# EAGLE design Hauptstation (EAGLE 7.3.0)
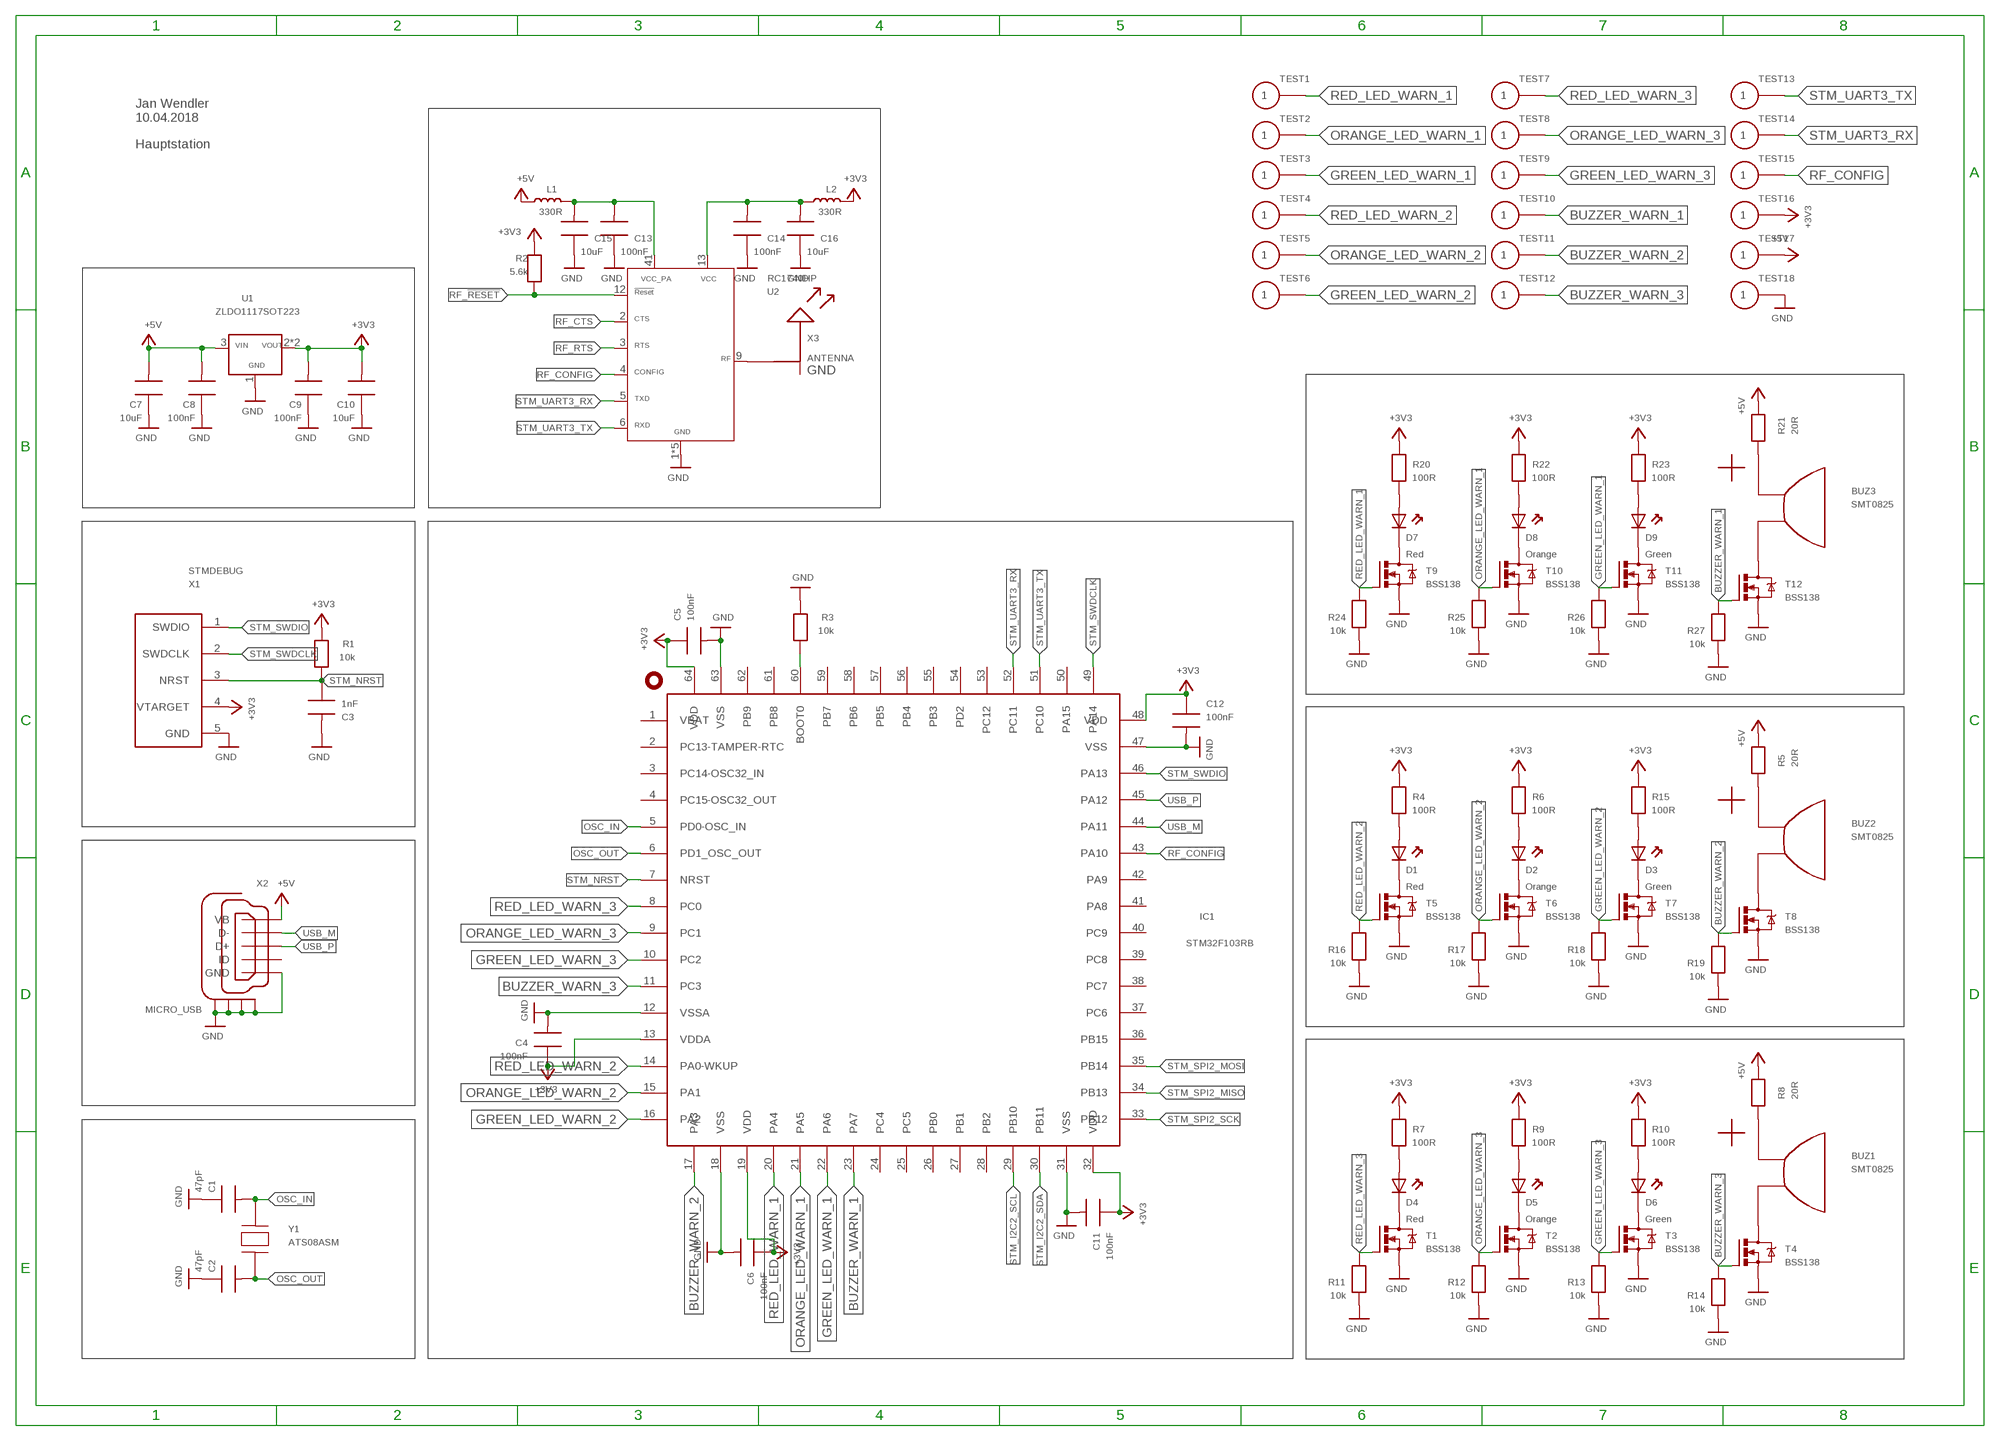
[diagram p0: schematic, sheet 1]

## Parts
BUZ1  SMT0825  [SMT0825]
BUZ2  SMT0825  [SMT0825]
BUZ3  SMT0825  [SMT0825]
C1  47pF  C0603  [0603]
C2  47pF  C0603  [0603]
C3  1nF  C0603  [0603]
C4  100nF  C0603  [0603]
C5  100nF  C0603  [0603]
C6  100nF  C0603  [0603]
C7  10uF  C0603  [0603]
C8  100nF  C0603  [0603]
C9  100nF  C0603  [0603]
C10  10uF  C0603  [0603]
C11  100nF  C0603  [0603]
C12  100nF  C0603  [0603]
C13  100nF  C0603  [0603]
C14  100nF  C0603  [0603]
C15  10uF  C0603  [0603]
C16  10uF  C0603  [0603]
D1  Red  D0603  [0603]
D2  Orange  D0603  [0603]
D3  Green  D0603  [0603]
D4  Red  D0603  [0603]
D5  Orange  D0603  [0603]
D6  Green  D0603  [0603]
D7  Red  D0603  [0603]
D8  Orange  D0603  [0603]
D9  Green  D0603  [0603]
IC1  STM32F103RB  [LQFP64]
L1  330R  L0603  [0603]
L2  330R  L0603  [0603]
R1  10k  R0603  [0603]
R2  5.6k  R0603  [0603]
R3  10k  R0603  [0603]
R4  100R  R0603  [0603]
R5  20R  R0603  [0603]
R6  100R  R0603  [0603]
R7  100R  R0603  [0603]
R8  20R  R0603  [0603]
R9  100R  R0603  [0603]
R10  100R  R0603  [0603]
R11  10k  R0603  [0603]
R12  10k  R0603  [0603]
R13  10k  R0603  [0603]
R14  10k  R0603  [0603]
R15  100R  R0603  [0603]
R16  10k  R0603  [0603]
R17  10k  R0603  [0603]
R18  10k  R0603  [0603]
R19  10k  R0603  [0603]
R20  100R  R0603  [0603]
R21  20R  R0603  [0603]
R22  100R  R0603  [0603]
R23  100R  R0603  [0603]
R24  10k  R0603  [0603]
R25  10k  R0603  [0603]
R26  10k  R0603  [0603]
R27  10k  R0603  [0603]
T1  BSS138  [SOT23]
T2  BSS138  [SOT23]
T3  BSS138  [SOT23]
T4  BSS138  [SOT23]
T5  BSS138  [SOT23]
T6  BSS138  [SOT23]
T7  BSS138  [SOT23]
T8  BSS138  [SOT23]
T9  BSS138  [SOT23]
T10  BSS138  [SOT23]
T11  BSS138  [SOT23]
T12  BSS138  [SOT23]
TEST1  TESTPIN  [TESTPIN]
TEST2  TESTPIN  [TESTPIN]
TEST3  TESTPIN  [TESTPIN]
TEST4  TESTPIN  [TESTPIN]
TEST5  TESTPIN  [TESTPIN]
TEST6  TESTPIN  [TESTPIN]
TEST7  TESTPIN  [TESTPIN]
TEST8  TESTPIN  [TESTPIN]
TEST9  TESTPIN  [TESTPIN]
TEST10  TESTPIN  [TESTPIN]
TEST11  TESTPIN  [TESTPIN]
TEST12  TESTPIN  [TESTPIN]
TEST13  TESTPIN  [TESTPIN]
TEST14  TESTPIN  [TESTPIN]
TEST15  TESTPIN  [TESTPIN]
TEST16  TESTPIN  [TESTPIN]
TEST17  TESTPIN  [TESTPIN]
TEST18  TESTPIN  [TESTPIN]
U1  ZLDO1117SOT223  [SOT223]
U2  RC1740HP  [RADIOCRAFTS_MODULE]
X1  STMDEBUG  [STIFTLEISTE1X5]
X2  MICRO_USB  [MICRO-USB]
X3  ANTENNA  [ANTENNE_CON]
Y1  ATS08ASM  [HC49/US]

## Nets
+3V3 [Power]: C4.2 C5.2 C6.2 C9.1 C10.1 C11.2 C12.2 IC1.13(VDDA) IC1.19(VDD) IC1.32(VDD) IC1.48(VDD) IC1.64(VDD) L2.1 R1.2 R2.2 R4.2 R6.2 R7.2 R9.2 R10.2 R15.2 R20.2 R22.2 R23.2 TEST16.1 U1.2(VOUT) U1.PAD(VOUT) X1.4(VTARGET)
+5V [Power]: C7.1 C8.1 L1.2 R5.2 R8.2 R21.2 TEST17.1 U1.3(VIN) X2.1(VB)
BUZZER_WARN_1: IC1.23(PA7) R27.2 T12.1(G) TEST10.1
BUZZER_WARN_2: IC1.17(PA3) R19.2 T8.1(G) TEST11.1
BUZZER_WARN_3: IC1.11(PC3) R14.2 T4.1(G) TEST12.1
GND [Power]: C1.2 C2.2 C3.1 C4.1 C5.1 C6.1 C7.2 C8.2 C9.2 C10.2 C11.1 C12.1 C13.2 C14.2 C15.2 C16.2 IC1.12(VSSA) IC1.18(VSS) IC1.31(VSS) IC1.47(VSS) IC1.63(VSS) R3.2 R11.1 R12.1 R13.1 R14.1 R16.1 R17.1 R18.1 R19.1 R24.1 R25.1 R26.1 R27.1 T1.2(S) T2.2(S) T3.2(S) T4.2(S) T5.2(S) T6.2(S) T7.2(S) T8.2(S) T9.2(S) T10.2(S) T11.2(S) T12.2(S) TEST18.1 U1.1(GND) U2.1(GND) U2.7(GND) U2.8(GND) U2.10(GND) U2.14(GND) X1.5(GND) X2.5(GND) X2.GND1(S1) X2.GND2(S2) X2.GND3(S3) X2.GND4(S4)
GREEN_LED_WARN_1: IC1.22(PA6) R26.2 T11.1(G) TEST3.1
GREEN_LED_WARN_2: IC1.16(PA2) R18.2 T7.1(G) TEST6.1
GREEN_LED_WARN_3: IC1.10(PC2) R13.2 T3.1(G) TEST9.1
N$1 [Data]: U2.9(RF) X3.P$1
N$2 [Data]: C13.1 C15.1 L1.1 U2.41(VCC_PA)
N$3 [Data]: C14.1 C16.1 L2.2 U2.13(VCC)
N$4: D4.1(ANODE) R7.1
N$5: D5.1(ANODE) R9.1
N$6: IC1.60(BOOT0) R3.1
N$7: D6.1(ANODE) R10.1
N$8: D4.2(KATHODE) T1.3(D)
N$9: D5.2(KATHODE) T2.3(D)
N$10: D6.2(KATHODE) T3.3(D)
N$11: BUZ1.+ R8.1
N$12: BUZ1.- T4.3(D)
N$13: D1.1(ANODE) R4.1
N$14: D2.1(ANODE) R6.1
N$15: D3.1(ANODE) R15.1
N$16: D1.2(KATHODE) T5.3(D)
N$17: D2.2(KATHODE) T6.3(D)
N$18: D3.2(KATHODE) T7.3(D)
N$19: BUZ2.+ R5.1
N$20: BUZ2.- T8.3(D)
N$21: D7.1(ANODE) R20.1
N$22: D8.1(ANODE) R22.1
N$23: D9.1(ANODE) R23.1
N$24: D7.2(KATHODE) T9.3(D)
N$25: D8.2(KATHODE) T10.3(D)
N$26: D9.2(KATHODE) T11.3(D)
N$27: BUZ3.+ R21.1
N$28: BUZ3.- T12.3(D)
ORANGE_LED_WARN_1: IC1.21(PA5) R25.2 T10.1(G) TEST2.1
ORANGE_LED_WARN_2: IC1.15(PA1) R17.2 T6.1(G) TEST5.1
ORANGE_LED_WARN_3: IC1.9(PC1) R12.2 T2.1(G) TEST8.1
OSC_IN [Data]: C1.1 IC1.5(PD0-OSC_IN) Y1.1
OSC_OUT [Data]: C2.1 IC1.6(PD1_OSC_OUT) Y1.2
RED_LED_WARN_1: IC1.20(PA4) R24.2 T9.1(G) TEST1.1
RED_LED_WARN_2: IC1.14(PA0-WKUP) R16.2 T5.1(G) TEST4.1
RED_LED_WARN_3: IC1.8(PC0) R11.2 T1.1(G) TEST7.1
RF_!RESET! [Data]: R2.1 U2.12(!RESET!)
RF_CONFIG [Data]: IC1.43(PA10) TEST15.1 U2.4(CONFIG)
RF_CTS [Data]: U2.2(CTS)
RF_RTS [Data]: U2.3(RTS)
STM_I2C2_SCL [Data]: IC1.29(PB10)
STM_I2C2_SDA [Data]: IC1.30(PB11)
STM_NRST [Data]: C3.2 IC1.7(NRST) R1.1 X1.3(NRST)
STM_SPI2_MISO [Data]: IC1.34(PB13)
STM_SPI2_MOSI [Data]: IC1.35(PB14)
STM_SPI2_SCK [Data]: IC1.33(PB12)
STM_SWDCLK [Data]: IC1.49(PA14) X1.2(SWDCLK)
STM_SWDIO [Data]: IC1.46(PA13) X1.1(SWDIO)
STM_UART3_RX [Data]: IC1.52(PC11) TEST14.1 U2.5(TXD)
STM_UART3_TX [Data]: IC1.51(PC10) TEST13.1 U2.6(RXD)
USB_M [Data]: IC1.44(PA11) X2.2(D-)
USB_P [Data]: IC1.45(PA12) X2.3(D+)
Unconnected: IC1.1(VBAT) IC1.2(PC13-TAMPER-RTC) IC1.3(PC14-OSC32_IN) IC1.4(PC15-OSC32_OUT) IC1.24(PC4) IC1.25(PC5) IC1.26(PB0) IC1.27(PB1) IC1.28(PB2) IC1.36(PB15) IC1.37(PC6) IC1.38(PC7) IC1.39(PC8) IC1.40(PC9) IC1.41(PA8) IC1.42(PA9) IC1.50(PA15) IC1.53(PC12) IC1.54(PD2) IC1.55(PB3) IC1.56(PB4) IC1.57(PB5) IC1.58(PB6) IC1.59(PB7) IC1.61(PB8) IC1.62(PB9) X2.4(ID) X3.P$2(GND)

## Notes on the sheet
- Jan Wendler
  10.04.2018
- Hauptstation

## Library data of the parts
BUZ1-BUZ3 = Warnsystem:SMT0825
C1-C16 = Hauptstation:C0603: Capacitor 0603
D1-D9 = Hauptstation:D0603: SMD LED 0603
IC1 = Hauptstation:STM32F103RB: STM32F103RB Digikey: 497-6066-ND
L1 L2 = Hauptstation:L0603: 0603 Spule
R1-R27 = Hauptstation:R0603: Resistor 0603
T1-T12 = Warnsystem:BSS138: N-Channel MOS FET BSS138 Ideal für LED ansteuerung
TEST1-TEST18 = Hauptstation:TESTPIN
U1 = Hauptstation:ZLDO1117: Voltage Regulator 3V3 / 1A / 1.3V DropOut Digikey: ZLDO1117G33DICT-ND
U2 = Hauptstation:RC1740HP: RC1740HC Digikey: 1783-1050-1-ND
X1 = Hauptstation:STMDEBUG: Debug Connector for STLinkV2 1x5 Stiftleiste
X2 = Hauptstation:MICRO_USB: Micro USB plug Digikey 609-4613-1-ND
X3 = Hauptstation:ANTENNA: RF Antenna 433Mhz
Y1 = Hauptstation:ATS08ASM: Crystal 8Mhz 20pF Digikey: CTX1055CT-ND

## Net classes
1 Power: width 0.254 mm, drill 0.5 mm, clearance 0.2 mm
2 Data: width 0.254 mm, drill 0.35 mm, clearance 0.2 mm

## Board
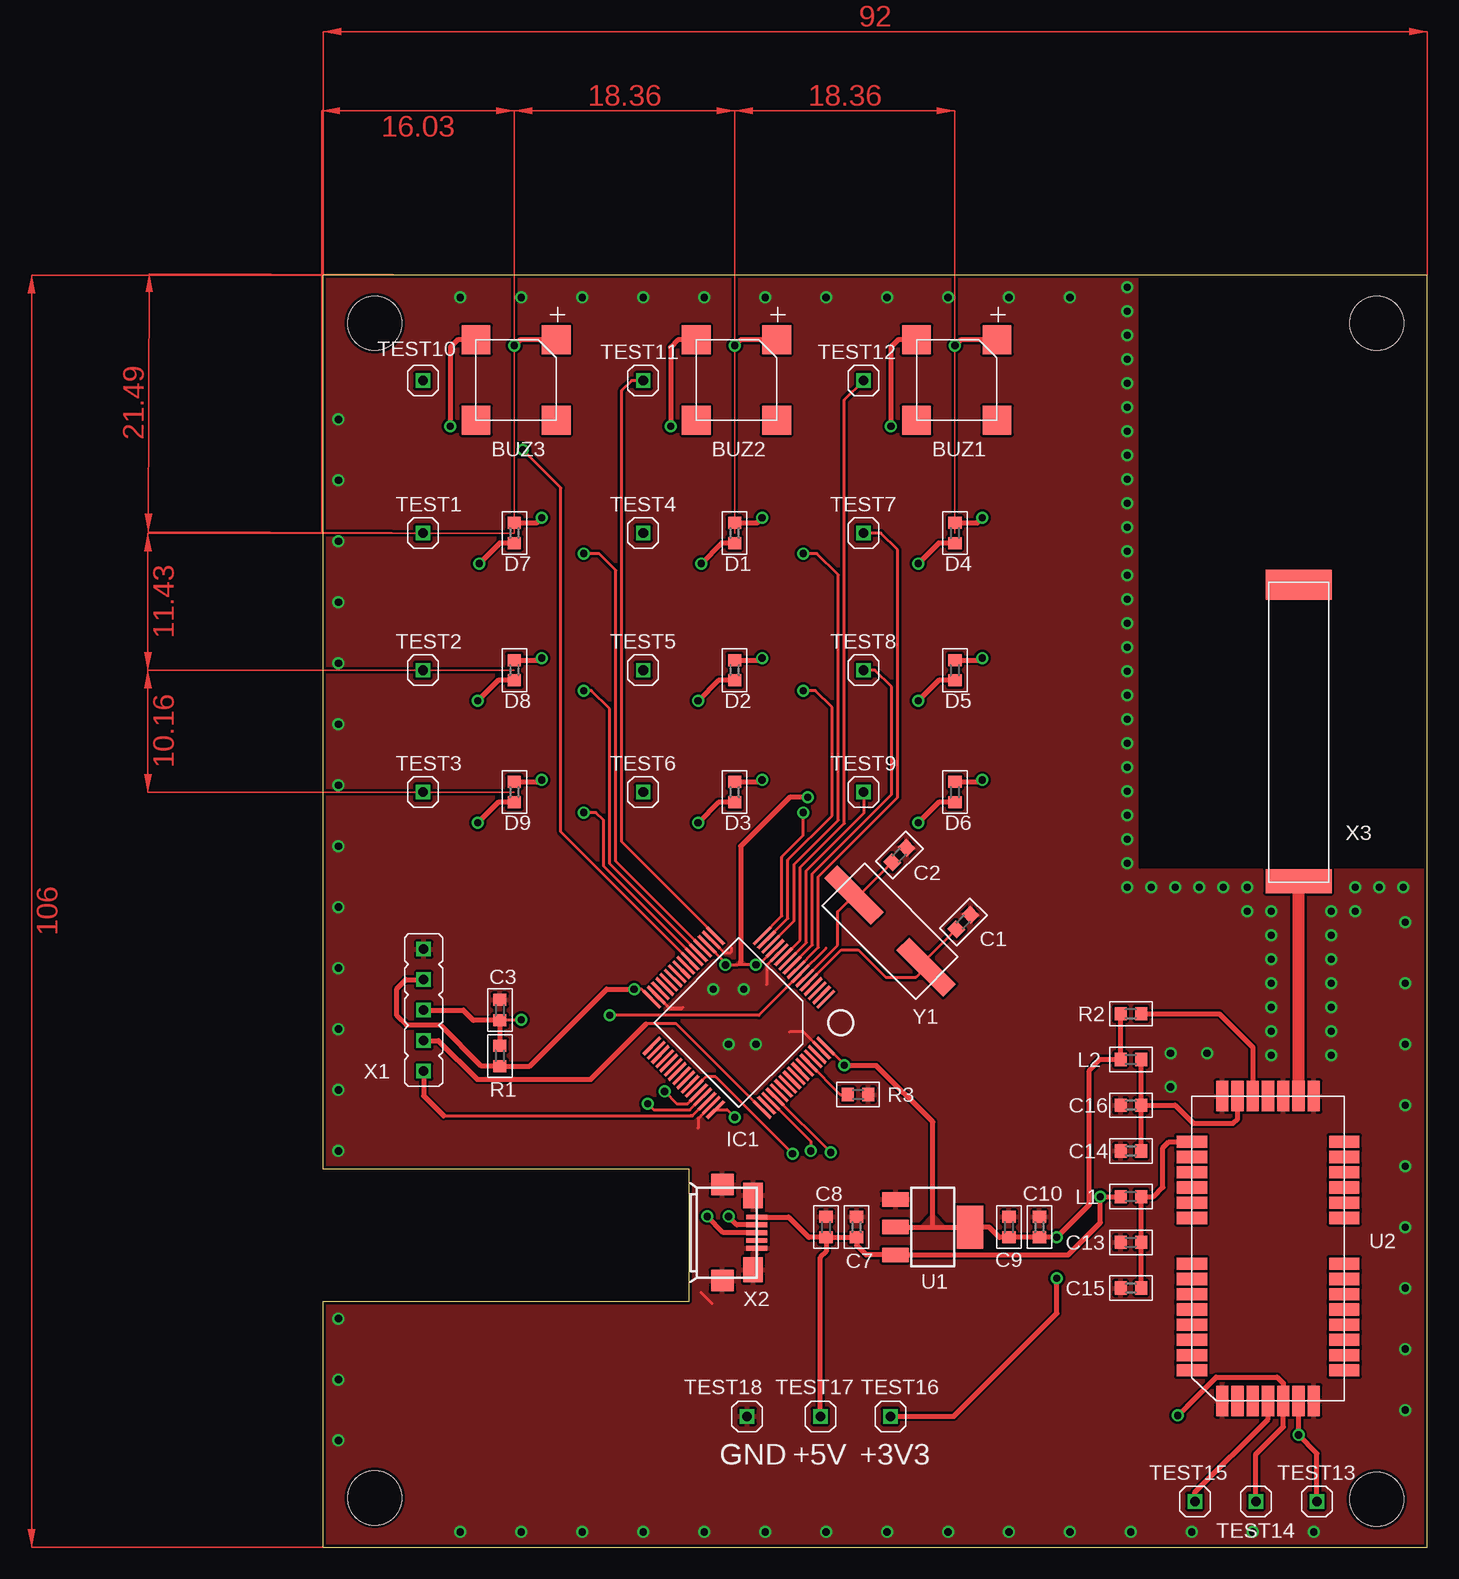
[diagram p1: board, top side]
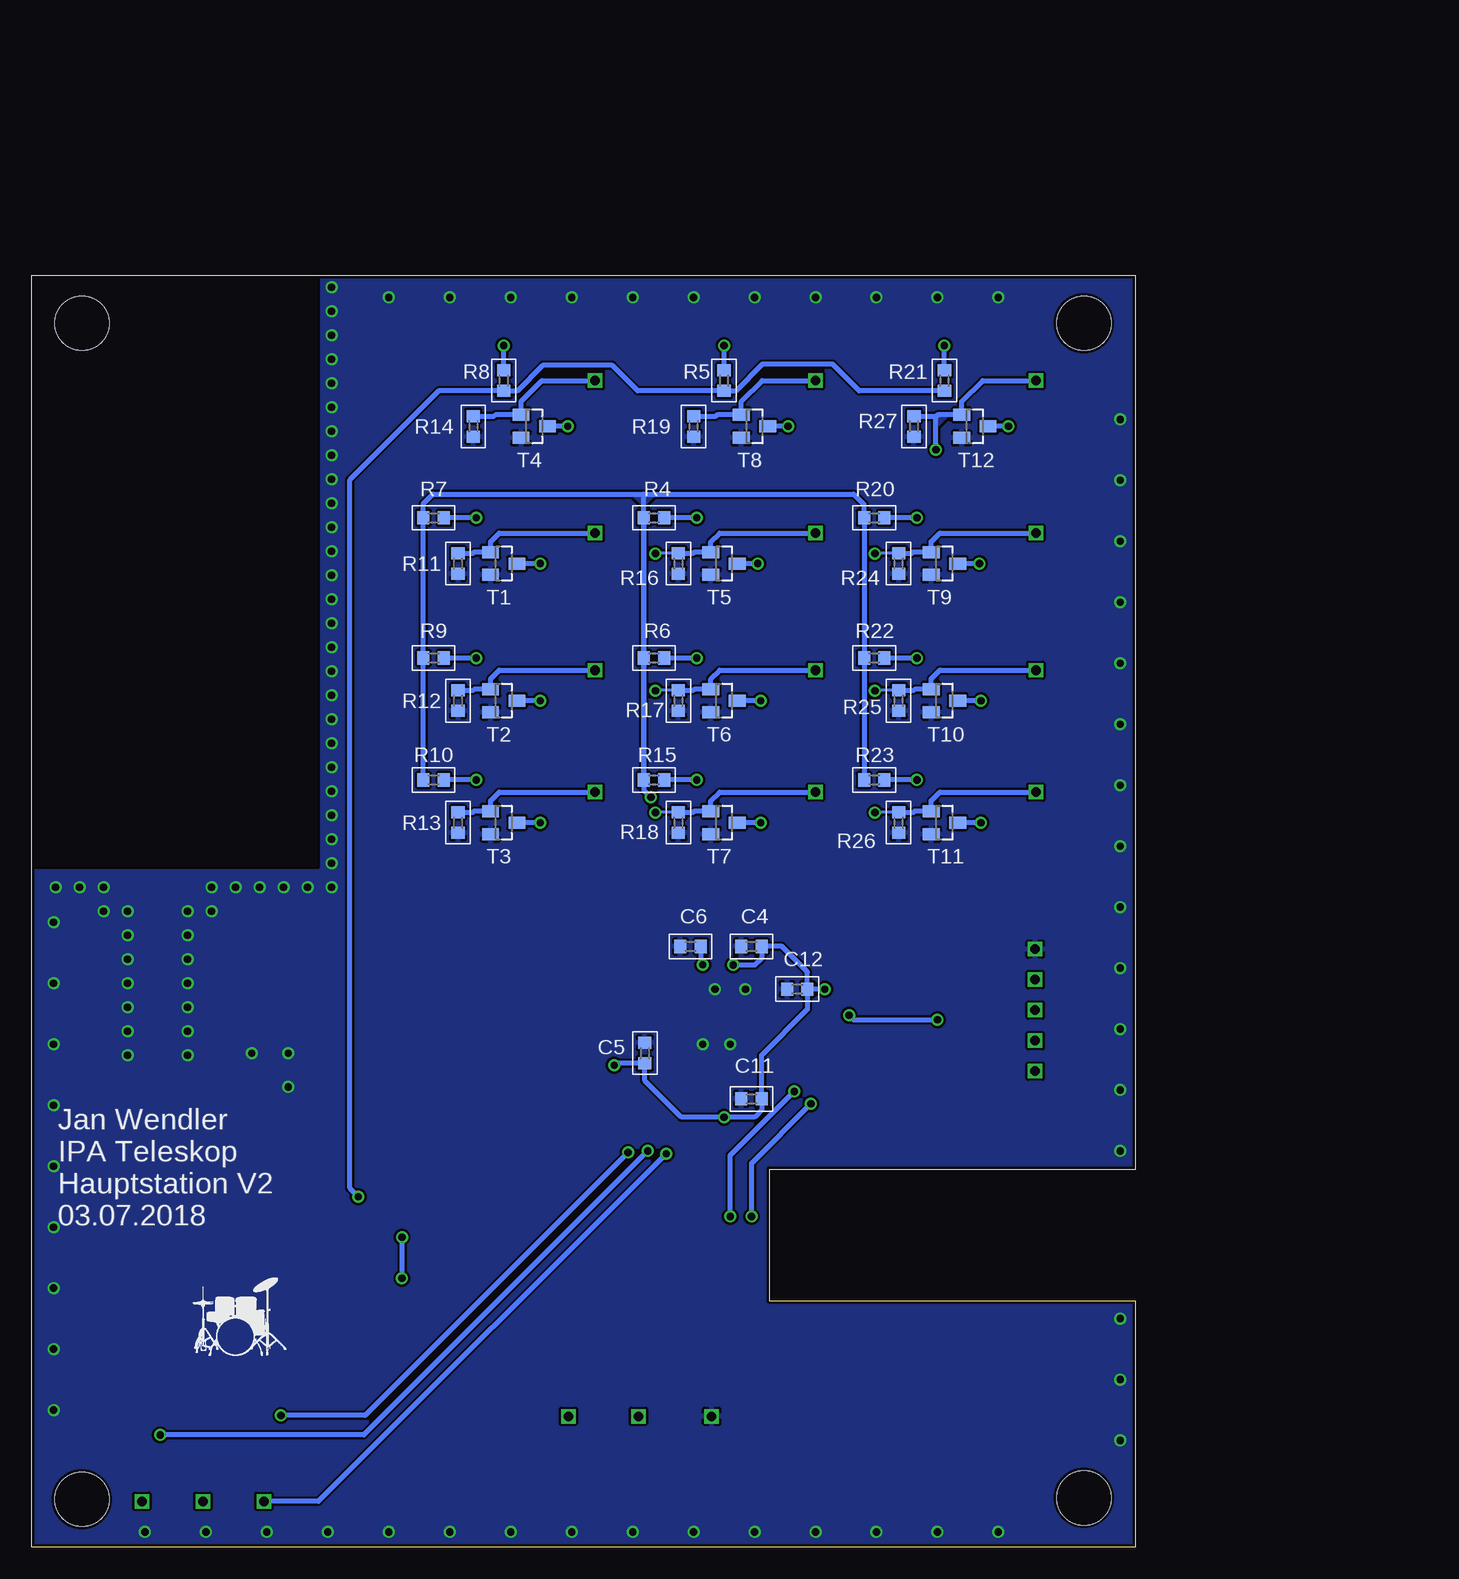
[diagram p2: board, bottom side, seen from below]

Size 92 x 106 mm. Coordinates in mm from the lower left corner, seen from the top.
Outline: 0,0 92,0 92,106 0,106 0,31.5 30.5,31.5 30.5,20.5 0,20.5 0,0
Copper layers (1*16): Top 0.018mm / dielectric 1.55mm / Bottom 0.018mm
Design rules "eC_2Layer_PClass6_BaseCopperO18_eCDefault *": minimum track width 0.15mm, minimum drill 0.35mm, track to track 0.15mm, track to pad 0.15mm, pad to pad 0.15mm, via to via 0.15mm, smd to smd 0mil, copper to edge 0.25mm, drill to drill 0.35mm, minimum pad ring 0.175mm, minimum via ring 0.125mm, stop-mask expansion 0mil, vias tented up to drill 0.45mm, thermal gap 0.2mm
Holes 4.5 mm at 4.3,4.1 87.8,4 87.8,102 4.3,102

### Footprints (pad centres in the part's own frame; a part is rotated, then mirrored left to right if it is on the bottom)
SMT0825 = smd 2.4 x 2.4: + -3.4,3.5; - -3.4,-3.2; NC@1 3.3,3.5; NC@2 3.3,-3.2
0603 = smd 1 x 1.1: 1 -0.85,0; 2 0.85,0
LQFP64 = smd 2 x 0.26: 1 -6.75,4; 2 -6.75,3.5; 3 -6.75,3; 4 -6.75,2.5; 5 -6.75,2; 6 -6.75,1.5; 7 -6.75,1; 8 -6.75,0.5; 9 -6.75,0; 10 -6.75,-0.5; 11 -6.75,-1; 12 -6.75,-1.5; 13 -6.75,-2; 14 -6.75,-2.5; 15 -6.75,-3; 16 -6.75,-3.5; 33 6.25,-3.5; 34 6.25,-3; 35 6.25,-2.5; 36 6.25,-2; 37 6.25,-1.5; 38 6.25,-1; 39 6.25,-0.5; 40 6.25,0; 41 6.25,0.5; 42 6.25,1; 43 6.25,1.5; 44 6.25,2; 45 6.25,2.5; 46 6.25,3; 47 6.25,3.5; 48 6.25,4 | smd 0.26 x 2: 17 -4,-6.25; 18 -3.5,-6.25; 19 -3,-6.25; 20 -2.5,-6.25; 21 -2,-6.25; 22 -1.5,-6.25; 23 -1,-6.25; 24 -0.5,-6.25; 25 0,-6.25; 26 0.5,-6.25; 27 1,-6.25; 28 1.5,-6.25; 29 2,-6.25; 30 2.5,-6.25; 31 3,-6.25; 32 3.5,-6.25; 49 3.5,6.75; 50 3,6.75; 51 2.5,6.75; 52 2,6.75; 53 1.5,6.75; 54 1,6.75; 55 0.5,6.75; 56 0,6.75; 57 -0.5,6.75; 58 -1,6.75; 59 -1.5,6.75; 60 -2,6.75; 61 -2.5,6.75; 62 -3,6.75; 63 -3.5,6.75; 64 -4,6.75
SOT23 = smd 1 x 1.4: 1 -0.95,-1.1; 2 0.95,-1.1; 3 0,1.1
TESTPIN = drill 0.8 square: 1 0,0
SOT223 = smd 1.219 x 2.235: 1 -2.311,-3.099; 2 0,-3.099; 3 2.311,-3.099 | smd 3.6 x 2.2: PAD 0,3.099
RADIOCRAFTS_MODULE = smd 2.54 x 1.016: 1 -12.7,10.16; 2 -12.7,8.89; 3 -12.7,7.62; 4 -12.7,6.35; 5 -12.7,5.08; 6 -12.7,3.81; 7 -12.7,2.54; 8 12.7,2.54; 9 12.7,3.81; 10 12.7,5.08; 11 12.7,6.35; 12 12.7,7.62; 13 12.7,8.89; 14 12.7,10.16 | smd 1.016 x 2.54: 15 -10.16,0; 16 -8.89,0; 17 -7.62,0; 18 -6.35,0; 19 -5.08,0; 20 -3.81,0; 21 -2.54,0; 22 -1.27,0; 23 -1.27,12.7; 24 -2.54,12.7; 25 -3.81,12.7; 26 -5.08,12.7; 27 -6.35,12.7; 28 -7.62,12.7; 29 -8.89,12.7; 30 -10.16,12.7; 31 2.54,12.7; 32 2.54,0; 33 3.81,12.7; 34 3.81,0; 35 5.08,12.7; 36 5.08,0; 37 6.35,12.7; 38 6.35,0; 39 7.62,12.7; 40 7.62,0; 41 8.89,12.7; 42 8.89,0
STIFTLEISTE1X5 = drill 0.8 square: 1 0,0; 2 2.54,0; 3 5.08,0; 4 7.62,0; 5 10.16,0
MICRO-USB = smd 0.4 x 1.75: 1 -1.3,2.875; 2 -0.65,2.875; 3 0,2.875; 4 0.65,2.875; 5 1.3,2.875 | smd 1.8 x 1.9: GND1 -4,0; GND2 4,0 | smd 2.1 x 1.6: GND3 -3.1,2.55; GND4 3.1,2.55
ANTENNE_CON = smd 2 x 5.5: P$1 0,0 | smd 2.5 x 5.5: P$2 24.7,0
HC49/US = smd 5.5 x 1.5: 1 -4.25,0; 2 4.25,0

### Placement (x,y rotation side)
BUZ1  52.65,97.21 270 top
BUZ2  34.29,97.21 270 top
BUZ3  15.93,97.21 270 top
C1  53.35,52.1 45 top
C2  48.01,57.68 45 top
C3  14.72,44.75 270 top
C4  32,50.06 0 bottom
C5  40.89,41.17 270 bottom
C6  37.08,50.06 0 bottom
C7  44.45,26.67 90 top
C8  41.91,26.67 90 top
C9  59.69,26.67 90 top
C10  57.15,26.67 90 top
C11  32,37.36 0 bottom
C12  28.19,46.5 0 bottom
C13  67.31,25.4 180 top
C14  67.31,33.02 180 top
C15  67.31,21.59 180 top
C16  67.31,36.83 180 top
D1  34.29,84.51 270 top
D2  34.29,73.08 270 top
D3  34.29,62.92 270 top
D4  52.65,84.51 270 top
D5  52.65,73.08 270 top
D6  52.65,62.92 270 top
D7  15.93,84.51 270 top
D8  15.93,73.08 270 top
D9  15.93,62.92 270 top
IC1  34.29,43.71 225 top
L1  67.31,29.21 180 top
L2  67.31,40.64 0 top
R1  14.72,40.94 270 top
R2  67.31,44.45 180 top
R3  44.58,37.72 0 top
R4  40.13,85.78 180 bottom
R5  34.29,97.21 270 bottom
R6  40.13,74.1 180 bottom
R7  58.49,85.78 180 bottom
R8  52.65,97.21 270 bottom
R9  58.49,74.1 180 bottom
R10  58.49,63.94 180 bottom
R11  56.46,81.97 90 bottom
R12  56.46,70.54 90 bottom
R13  56.46,60.38 90 bottom
R14  55.19,93.4 90 bottom
R15  40.13,63.94 180 bottom
R16  38.1,81.97 90 bottom
R17  38.1,70.54 90 bottom
R18  38.1,60.38 90 bottom
R19  36.83,93.4 90 bottom
R20  21.77,85.78 180 bottom
R21  15.93,97.21 270 bottom
R22  21.77,74.1 180 bottom
R23  21.77,63.94 180 bottom
R24  19.74,81.97 90 bottom
R25  19.74,70.54 90 bottom
R26  19.74,60.38 90 bottom
R27  18.47,93.4 90 bottom
T1  52.65,81.97 270 bottom
T2  52.65,70.54 270 bottom
T3  52.65,60.38 270 bottom
T4  50.11,93.4 270 bottom
T5  34.29,81.97 270 bottom
T6  34.29,70.54 270 bottom
T7  34.29,60.38 270 bottom
T8  31.75,93.4 270 bottom
T9  15.93,81.97 270 bottom
T10  15.93,70.54 270 bottom
T11  15.93,60.38 270 bottom
T12  13.39,93.4 270 bottom
TEST1  8.31,84.51 0 top
TEST2  8.31,73.08 0 top
TEST3  8.31,62.92 0 top
TEST4  26.67,84.51 0 top
TEST5  26.67,73.08 0 top
TEST6  26.67,62.92 0 top
TEST7  45.03,84.51 0 top
TEST8  45.03,73.08 0 top
TEST9  45.03,62.92 0 top
TEST10  8.31,97.21 0 top
TEST11  26.67,97.21 0 top
TEST12  45.03,97.21 0 top
TEST13  82.8,3.81 0 top
TEST14  77.72,3.81 0 top
TEST15  72.64,3.81 0 top
TEST16  47.27,10.9 90 top
TEST17  41.43,10.9 90 top
TEST18  35.33,10.9 90 top
U1  50.8,26.67 270 top
U2  85.09,24.89 90 top
X1  8.37,39.67 90 top
X2  33.28,26.21 270 top
X3  81.28,55.5 90 top
Y1  47.24,51.33 135 top

### Tracks (layer width: path | path; a pad name or v marks a point on that pad's centre or on a via)
+3V3  (via drill 0.6 pad 1)
  Top 0.254: IC1.32 26.55,46.5 v25.91,46.5 | IC1.13 36.29,48.54 v36.07,48.54 34.57,48.54 | IC1.48 33.66,36.46 v34.29,35.84 | IC1.64 43.43,40.22 v43.43,40.15 | IC1.19 33.53,48.72 v33.53,48.51 33.55,48.54 34.57,48.54 | 34.57,48.54 34.8,48.77
  Top 0.406: 66.45,40.65 L2.1 | 50.8,26.67 U1.PAD 55.5,26.67 56.35,25.82 C10.1 C9.1 v61.13,25.82 63.84,28.54 63.84,39.71 64.77,40.64 L2.1 | X1.4 6.9,47.29 6.14,46.53 6.14,44.29 6.95,43.48 9.8,43.48 13.19,40.09 R1.2 17.21,40.09 23.62,46.5 v25.91,46.5 | v40.39,62.48 38.86,62.48 34.8,58.42 34.8,48.77 | U1.2 50.8,26.67 | 50.8,26.67 50.8,35.43 46.1,40.13 43.46,40.13 v43.43,40.15 | TEST16.1 52.55,10.9 61.14,19.48 v61.14,22.4 | L2.1 R2.2
  Bottom 0.254: v34.29,35.84 33.78,35.84
  Bottom 0.406: R10.2 R9.2 R7.2 59.34,86.96 58.55,87.76 41.02,87.76 | C12.2 27.34,44.81 31.15,41 C11.2 31.15,36.43 31.75,35.84 33.78,35.84 | C12.2 27.34,47.94 29.46,50.06 C4.2 31.15,49.09 31.73,48.51 v33.53,48.51 | v34.29,35.84 37.85,35.84 40.89,38.88 C5.2 43.27,40.32 v43.43,40.15 | v25.91,46.5 C12.2 | C6.2 36.23,48.7 v36.07,48.54 | R23.2 R22.2 R20.2 22.62,86.88 23.5,87.76 41.02,87.76 | R4.2 R6.2 R15.2 | R15.2 40.98,87.72 41.02,87.76 | R15.2 40.98,63.08 v40.39,62.48 | v61.14,22.4 61.13,22.41 v61.13,25.82
  pour Bottom: 41,86.95 40.23,87.71 41.76,87.71
  pour Top (no thermals): 34.39,48.56 34.8,48.97 35.2,48.56
  pour Top: 49.91,26.67 50.8,27.56 51.69,26.67
+5V  (via drill 0.6 pad 1)
  Top 0.406: L1.2 v64.77,29.21 64.77,27.05 62.08,24.36 U1.3 45.24,24.36 44.45,25.15 C7.1 C8.1 | X2.1 38.78,27.51 40.47,25.82 C8.1 | TEST17.1 41.43,24.16 41.91,24.64 C8.1
  Bottom 0.406: R21.2 23.03,96.36 25.25,98.58 31.09,98.58 33.33,96.35 34.28,96.35 R5.2 41.49,96.36 43.61,98.48 49.4,98.48 51.53,96.35 52.64,96.35 R8.2 58.07,96.36 65.48,88.95 65.48,29.92 v64.77,29.21
BUZZER_WARN_1  (via drill 0.6 pad 1)
  Top 0.254: IC1.23 19.81,59.6 19.81,88.27 v16.64,91.44
  Bottom 0.406: 16.6,94.25 16.5,94.35 T12.1 14.49,95.47 12.76,97.21 TEST10.1 | R27.2 16.6,94.25 | v16.64,91.44 16.64,94.22 16.6,94.25
  pour Bottom (no thermals): 16.54,94.28 15.8,94.28 16.48,93.6 16.51,93.57 16.54,93.55
BUZZER_WARN_2
  Top 0.254: IC1.17 24.89,58.77 24.89,96.39 25.71,97.21 TEST11.1
  Bottom 0.406: R19.2 34.96,94.25 34.86,94.35 T8.1 32.85,95.47 31.11,97.21 TEST11.1
BUZZER_WARN_3
  Top 0.254: IC1.11 39.75,50.59 39.75,56.64 43.43,60.33 43.43,95.61 TEST12.1
  Bottom 0.406: R14.2 53.45,94.25 53.35,94.35 T4.1 51.21,95.47 49.48,97.21 TEST12.1
GND  (via drill 0.6 pad 1)
  Top 0.254: 36.99,48.54 IC1.12 36.96,48.5 36.96,46.88 | IC1.63 40,42.95 38.86,42.95 | IC1.47 31.5,35.97 31.5,35.96 IC1.47 | 31.5,21.21 32.38,20.32 | 29.84,44.85 28.9,44.85 IC1.31 28.8,44.96 29.97,44.96 | IC1.47 31.24,35.71 31.24,34.92 | IC1.18 33.42,49.53 33.91,49.53 34.04,49.66 34.04,49.91
  other vias: 70.61,38.35 70.61,41.15 73.66,41.15 77,55 75,55 73,55 71,55 69,55 67,55 67,57 67,59 67,61 67,63 67,65 67,67 67,69 67,71 67,73 67,75 67,77 67,79 67,81 67,83 67,85 67,87 67,89 67,91 67,93 67,95 67,97 67,99 67,101 67,103 67,105 77,53 79,53 79,51 79,49 79,47 79,45 79,43 79,41 84,45 84,47 84,49 84,51 84,53 84,43 84,41 86,53 86,55 88,55 90,55 32.51,46.48 35.05,46.48 33.78,41.91 36.07,41.91 1.27,33.02 1.27,38.1 1.27,43.18 1.27,48.26 1.27,53.34 1.27,58.42 1.27,63.5 1.27,68.58 1.27,73.66 1.27,78.74 1.27,83.82 1.27,88.9 1.27,93.98 11.43,104.14 16.51,104.14 21.59,104.14 26.67,104.14 31.75,104.14 36.83,104.14 41.91,104.14 46.99,104.14 52.07,104.14 57.15,104.14 62.23,104.14 1.27,19.05 1.27,13.97 1.27,8.89 11.43,1.27 16.51,1.27 21.59,1.27 26.67,1.27 31.75,1.27 36.83,1.27 41.91,1.27 46.99,1.27 52.07,1.27 57.15,1.27 62.23,1.27 67.31,1.27 72.39,1.27 77.47,1.27 82.55,1.27 90.17,11.43 90.17,16.51 90.17,21.59 90.17,26.67 90.17,31.75 90.17,36.83 90.17,41.91 90.17,46.99 90.17,52.07
  pour Bottom (rank 6): -2.54,-2.54 93.98,-2.54 93.98,108.87 -2.54,108.87
  pour Top (rank 6): -2.54,-2.54 93.98,-2.54 93.98,110.41 -2.54,110.41
  cutout Bottom: 91.95,56.64 68.07,56.64 68.07,106.35 91.95,106.35
  cutout Top: 91.95,56.64 68.07,56.64 68.07,107.58 91.95,107.58
GREEN_LED_WARN_1  (via drill 0.6 pad 1)
  Top 0.254: IC1.22 23.37,56.75 23.37,60.58 22.73,61.21 v21.72,61.21
  Bottom 0.254: R26.2 21.7,61.23 v21.72,61.21
  Bottom 0.406: R26.2 18.51,61.23 18.41,61.33 T11.1 17.03,62.2 16.31,62.92 TEST3.1
GREEN_LED_WARN_2  (via drill 0.6 pad 1)
  Top 0.254: IC1.16 38.23,52.6 38.23,57.53 40.01,59.31 v40.01,61.21
  Bottom 0.254: R18.2 39.99,61.23 v40.01,61.21
  Bottom 0.406: R18.2 36.87,61.23 36.77,61.33 T7.1 35.39,62.2 34.67,62.92 TEST6.1
GREEN_LED_WARN_3
  Top 0.254: IC1.10 40.26,50.39 40.26,56.39 45.03,61.16 TEST9.1
  Bottom 0.406: R13.2 55.23,61.23 55.13,61.33 T3.1 53.75,62.2 53.03,62.92 TEST9.1
N$1
  Top 1: U2.9 X3.P$1
N$2
  Top 0.406: C15.1 C13.1 L1.1 69.22,29.21 69.98,29.97 69.98,33.27 70.48,33.78 U2.41
N$3
  Top 0.406: C14.1 C16.1 | C16.1 L2.2 | C16.1 70.99,36.83 72.52,35.31 75.82,35.31 76.2,35.69 U2.13
N$4  (via drill 0.6 pad 1)
  Top 0.406: D4.1 54.52,85.36 v54.94,85.78
  Bottom 0.406: v54.94,85.78 R7.1
N$5  (via drill 0.6 pad 1)
  Top 0.406: D5.1 54.77,73.93 v54.94,74.1
  Bottom 0.406: v54.94,74.1 R9.1
N$6
  Top 0.254: IC1.60 43.11,37.72 R3.1
N$7  (via drill 0.6 pad 1)
  Top 0.406: D6.1 54.77,63.77 v54.94,63.94
  Bottom 0.406: v54.94,63.94 R10.1
N$8  (via drill 0.6 pad 1)
  Top 0.406: D4.2 51.29,83.66 v49.6,81.97
  Bottom 0.406: v49.6,81.97 T1.3
N$9  (via drill 0.6 pad 1)
  Top 0.406: D5.2 51.29,72.23 v49.6,70.54
  Bottom 0.406: v49.6,70.54 T2.3
N$10  (via drill 0.6 pad 1)
  Top 0.406: D6.2 51.29,62.07 v49.6,60.38
  Bottom 0.406: v49.6,60.38 T3.3
N$11  (via drill 0.6 pad 1)
  Top 0.406: BUZ1.+ 53.13,100.61 v52.65,100.13
  Bottom 0.406: R8.1 v52.65,100.13
N$12  (via drill 0.6 pad 1)
  Top 0.406: BUZ1.- 47.92,100.61 47.32,100 v47.32,93.4
  Bottom 0.406: v47.32,93.4 T4.3
N$13  (via drill 0.6 pad 1)
  Top 0.406: D1.1 36.16,85.36 v36.58,85.78
  Bottom 0.406: v36.58,85.78 R4.1
N$14  (via drill 0.6 pad 1)
  Top 0.406: D2.1 36.41,73.93 v36.58,74.1
  Bottom 0.406: v36.58,74.1 R6.1
N$15  (via drill 0.6 pad 1)
  Top 0.406: D3.1 36.41,63.77 v36.58,63.94
  Bottom 0.406: v36.58,63.94 R15.1
N$16  (via drill 0.6 pad 1)
  Top 0.406: D1.2 33.19,83.66 v31.5,81.97
  Bottom 0.406: v31.5,81.97 T5.3
N$17  (via drill 0.6 pad 1)
  Top 0.406: D2.2 32.93,72.23 v31.24,70.54
  Bottom 0.406: v31.24,70.54 T6.3
N$18  (via drill 0.6 pad 1)
  Top 0.406: D3.2 32.93,62.07 v31.24,60.38
  Bottom 0.406: v31.24,60.38 T7.3
N$19  (via drill 0.6 pad 1)
  Top 0.406: BUZ2.+ 34.77,100.61 v34.29,100.13
  Bottom 0.406: R5.1 v34.29,100.13
N$20  (via drill 0.6 pad 1)
  Top 0.406: BUZ2.- 29.56,100.61 28.96,100 v28.96,93.4
  Bottom 0.406: v28.96,93.4 T8.3
N$21  (via drill 0.6 pad 1)
  Top 0.406: D7.1 17.8,85.36 v18.22,85.78
  Bottom 0.406: v18.22,85.78 R20.1
N$22  (via drill 0.6 pad 1)
  Top 0.406: D8.1 18.05,73.93 v18.22,74.1
  Bottom 0.406: v18.22,74.1 R22.1
N$23  (via drill 0.6 pad 1)
  Top 0.406: D9.1 18.05,63.77 v18.22,63.94
  Bottom 0.406: v18.22,63.94 R23.1
N$24  (via drill 0.6 pad 1)
  Top 0.406: D7.2 14.7,83.66 v13.01,81.97
  Bottom 0.406: v13.01,81.97 T9.3
N$25  (via drill 0.6 pad 1)
  Top 0.406: D8.2 14.57,72.23 v12.88,70.54
  Bottom 0.406: v12.88,70.54 T10.3
N$26  (via drill 0.6 pad 1)
  Top 0.406: D9.2 14.57,62.07 v12.88,60.38
  Bottom 0.406: v12.88,60.38 T11.3
N$27  (via drill 0.6 pad 1)
  Top 0.406: BUZ3.+ 16.41,100.61 v15.93,100.13
  Bottom 0.406: R21.1 v15.93,100.13
N$28  (via drill 0.6 pad 1)
  Top 0.406: BUZ3.- 11.2,100.61 10.6,100 v10.6,93.4
  Bottom 0.406: v10.6,93.4 T12.3
ORANGE_LED_WARN_1  (via drill 0.6 pad 1)
  Top 0.254: IC1.21 23.88,56.95 23.88,69.85 22.35,71.37 v21.72,71.37
  Bottom 0.254: R25.2 21.7,71.39 v21.72,71.37
  Bottom 0.406: R25.2 18.51,71.39 18.41,71.49 T10.1 17.03,72.36 16.31,73.08 TEST2.1
ORANGE_LED_WARN_2  (via drill 0.6 pad 1)
  Top 0.254: IC1.15 38.73,52.4 38.73,57.28 42.42,60.96 42.42,69.98 41.02,71.37 v40.01,71.37
  Bottom 0.254: R17.2 39.99,71.39 v40.01,71.37
  Bottom 0.406: TEST5.1 34.67,73.08 35.39,72.36 T6.1 36.77,71.49 36.87,71.39 R17.2
ORANGE_LED_WARN_3
  Top 0.254: IC1.9 40.77,50.19 40.77,56.13 47.37,62.74 47.37,71.68 45.97,73.08 TEST8.1
  Bottom 0.406: R12.2 55.23,71.39 55.13,71.49 T2.1 53.75,72.36 53.03,73.08 TEST8.1
OSC_IN
  Top 0.254: C1.1 50.25,49 Y1.1 49.42,47.5 46.86,47.5 44.58,49.78 43.19,49.78 IC1.5
OSC_OUT
  Top 0.254: IC1.6 42.88,50.17 42.88,52.97 Y1.2 44.67,54.34 C2.1
RED_LED_WARN_1  (via drill 0.6 pad 1)
  Top 0.254: IC1.20 24.38,57.15 24.38,81.41 22.99,82.8 v21.72,82.8
  Bottom 0.254: R24.2 21.7,82.82 v21.72,82.8
  Bottom 0.406: R24.2 18.64,82.82 18.54,82.92 T9.1 17.03,83.79 16.31,84.51 TEST1.1
RED_LED_WARN_2  (via drill 0.6 pad 1)
  Top 0.254: IC1.14 39.24,52.2 39.24,56.9 42.93,60.58 42.93,81.03 41.15,82.8 v40.01,82.8
  Bottom 0.254: R16.2 39.99,82.82 v40.01,82.8
  Bottom 0.406: TEST4.1 34.67,84.51 35.39,83.79 T5.1 36.77,82.92 36.87,82.82 R16.2
RED_LED_WARN_3
  Top 0.254: IC1.8 41.27,49.99 41.27,55.88 47.88,62.48 47.88,83.11 46.48,84.51 TEST7.1
  Bottom 0.406: R11.2 55.23,82.82 55.13,82.92 T1.1 53.75,83.79 53.03,84.51 TEST7.1
RF_!RESET!
  Top 0.406: R2.1 74.68,44.45 77.47,41.66 U2.12
RF_CONFIG  (via drill 0.6 pad 1)
  Top 0.254: IC1.43 31.89,39.19 32.72,39.19 v39.12,32.79
  Top 0.406: TEST15.1 72.64,4.57 78.74,10.67 U2.4
  Bottom 0.406: v39.12,32.79 68.09,3.81 TEST15.1
STM_NRST  (via drill 0.6 pad 1)
  Top 0.254: 41.91,49.92 IC1.7 36.32,44.32 v23.88,44.32 | v16.51,43.94 16.47,43.9 C3.2
  Top 0.406: X1.3 11.68,44.75 12.53,43.9 C3.2 R1.1
  Bottom 0.406: v23.88,44.32 23.5,43.94 v16.51,43.94
STM_SWDCLK
  Top 0.254: IC1.49 29.44,43.61 26.92,43.61
  Top 0.406: X1.2 9.61,42.21 12.83,38.99 22.3,38.99 26.92,43.61
STM_SWDIO
  Top 0.254: IC1.46 30.76,35.94 | 30.76,35.94 30.61,35.94 | 10.03,35.94 30.76,35.94
  Top 0.406: X1.1 8.37,37.6 10.03,35.94
STM_UART3_RX  (via drill 0.6 pad 1)
  Top 0.254: IC1.52 v42.28,32.89 v42.29,32.89
  Top 0.406: TEST14.1 77.72,7.75 80.01,10.03 U2.5 80.01,13.66 79.5,14.17 74.42,14.17 72.03,11.79 v71.22,10.97
  Bottom 0.406: v42.29,32.89 64.21,10.97 v71.22,10.97
STM_UART3_TX  (via drill 0.6 pad 1)
  Top 0.254: 81.28,11.58 81.23,11.63 81.23,12.14 U2.6 | IC1.51 40.64,33.82 v40.64,33.02
  Top 0.406: 81.28,11.58 v81.28,9.35 82.8,7.82 TEST13.1
  Bottom 0.406: v81.28,9.35 64.31,9.35 v40.64,33.02
USB_M  (via drill 0.6 pad 1)
  Top 0.254: v28.45,37.97 29.46,36.96 30.36,36.96 IC1.44
  Top 0.406: X2.2 34.48,26.86 v33.78,27.56
  Bottom 0.406: v33.78,27.56 33.78,32.64 v28.45,37.97
USB_P  (via drill 0.6 pad 1)
  Top 0.254: v27.05,36.96 27.56,36.45 30.57,36.45 IC1.45
  Top 0.406: X2.3 33.35,26.21 v32,27.56
  Bottom 0.406: v32,27.56 32,32 v27.05,36.96
(copper drawn outside any net)
  shapes: Top area x8

### Text on the board
tPlace: GND | +5V | +3V3
bPlace: Jan Wendler / IPA Teleskop / Hauptstation V2 / 03.07.2018